# EAGLE design dual-encoding (EAGLE 7.5.0)
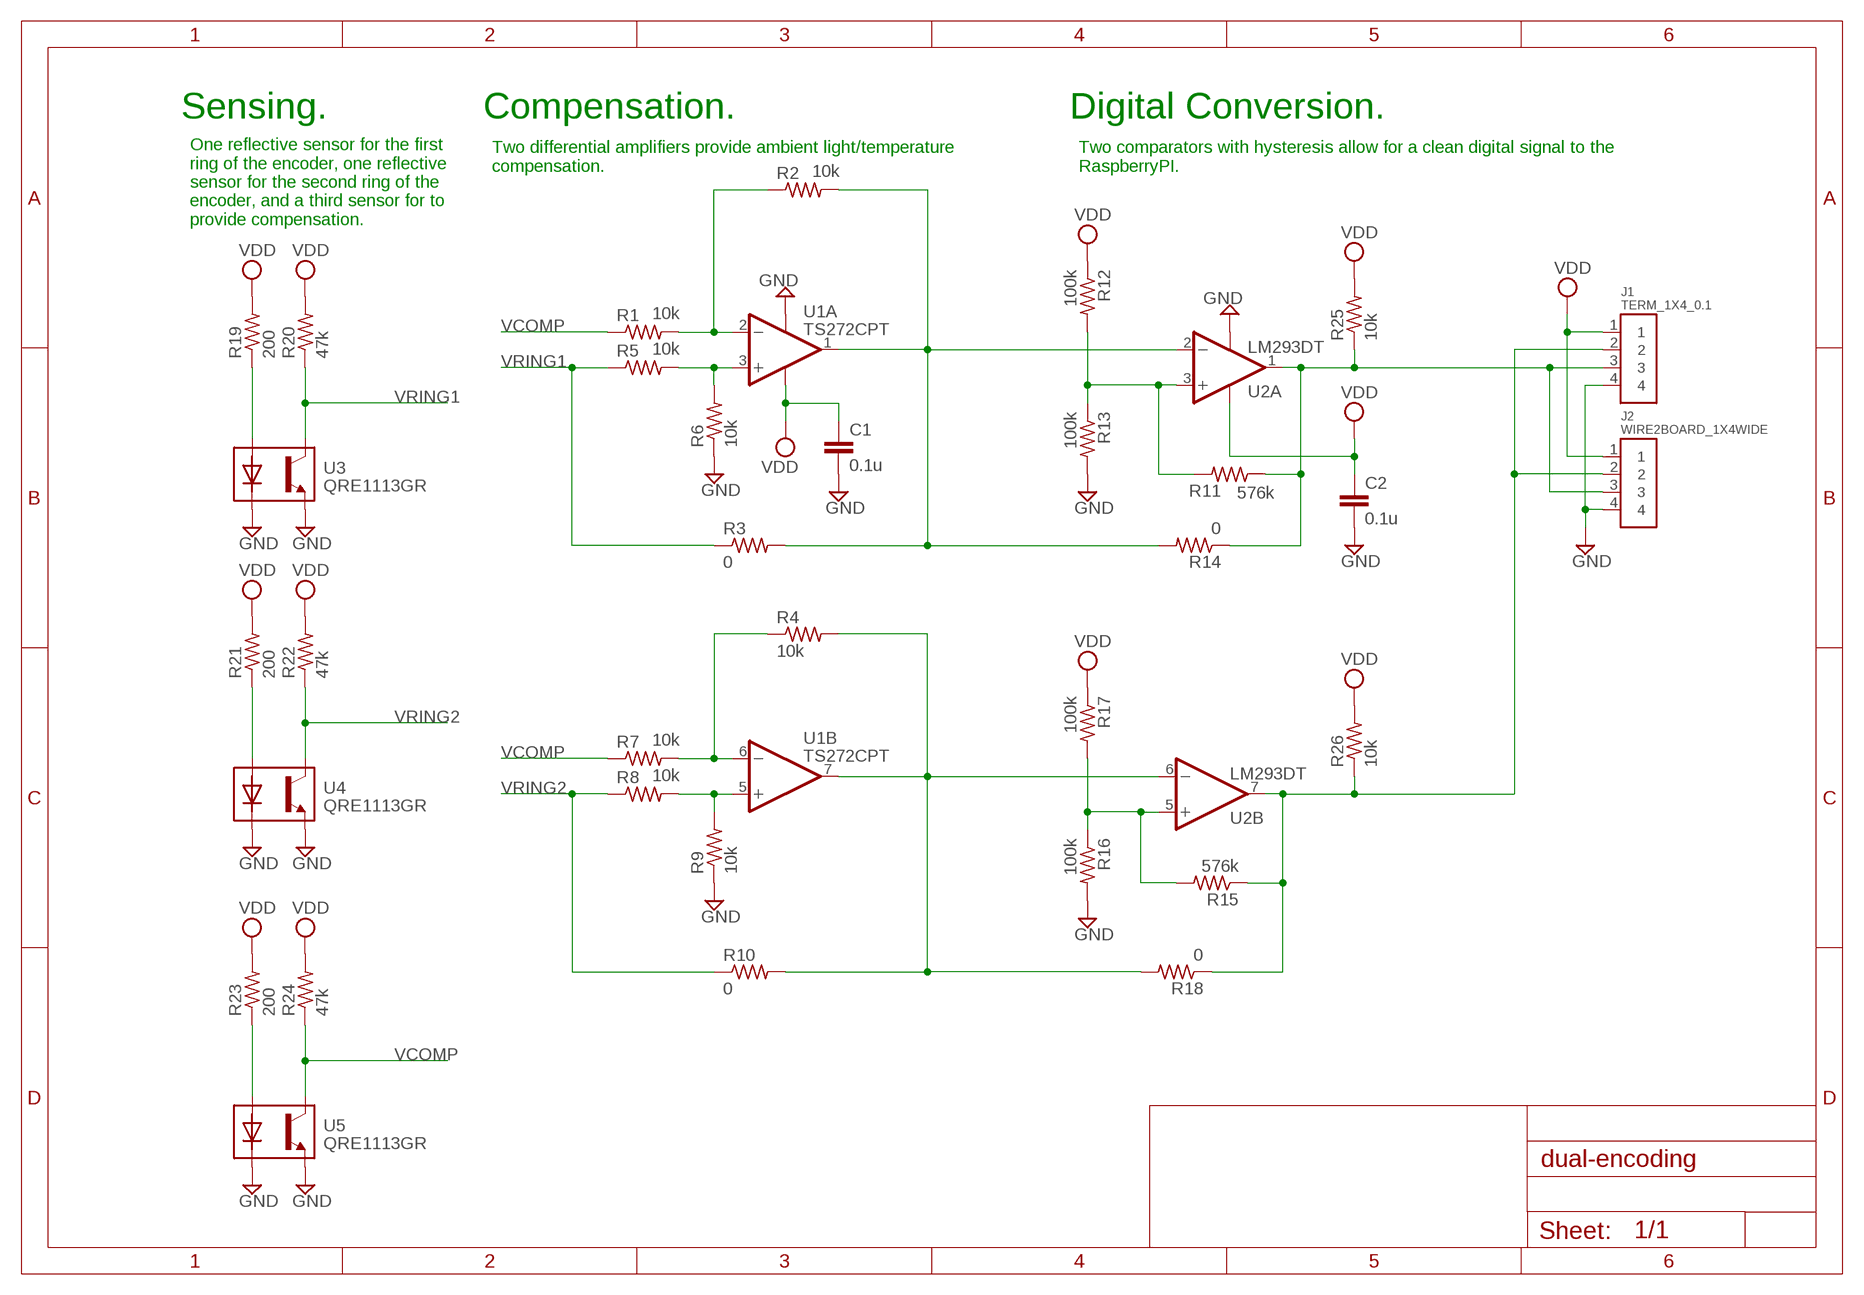
[diagram p0: schematic, sheet 1]

## Parts
C1  0.1u  C0805  [C0805]
C2  0.1u  C0805  [C0805]
J1  TERM_1X4_0.1  [TERM_1X4_0.1]
J2  WIRE2BOARD_1X4WIDE  [WIRE2BOARD_1X4W]
R1  10k  R  [R0805]
R2  10k  R  [R0805]
R3  0  R  [R0805]
R4  10k  R  [R0805]
R5  10k  R  [R0805]
R6  10k  R  [R0805]
R7  10k  R  [R0805]
R8  10k  R  [R0805]
R9  10k  R  [R0805]
R10  0  R  [R0805]
R11  576k  R  [R0805]
R12  100k  R  [R0805]
R13  100k  R  [R0805]
R14  0  R  [R0805]
R15  576k  R  [R0805]
R16  100k  R  [R0805]
R17  100k  R  [R0805]
R18  0  R  [R0805]
R19  200  R  [R0805]
R20  47k  R  [R0805]
R21  200  R  [R0805]
R22  47k  R  [R0805]
R23  200  R  [R0805]
R24  47k  R  [R0805]
R25  10k  R  [R0805]
R26  10k  R  [R0805]
U1  TS272CPT  [TSSOP8]
U2  LM293DT  [SOIC8]
U3  QRE1113GR  [REFL]
U4  QRE1113GR  [REFL]
U5  QRE1113GR  [REFL]

## Nets
GND: C1.2 C2.2 J1.4 J2.4 R6.1 R9.1 R13.2 R16.2 U1.4(A:V-) U2.4(A:V-) U3.2(DC) U3.4(E) U4.2(DC) U4.4(E) U5.2(DC) U5.4(E)
N$1: R5.2 R6.2 U1.3(A:+IN)
N$2: R1.2 R2.1 U1.2(A:-IN)
N$3: R2.2 R3.2 R14.2 U1.1(A:OUT) U2.2(A:-IN)
N$5: R4.1 R7.2 U1.6(B:-IN)
N$6: R4.2 R10.2 R18.2 U1.7(B:OUT) U2.6(B:-IN)
N$7: R8.2 R9.2 U1.5(B:+IN)
N$9: R11.2 R12.2 R13.1 U2.3(A:+IN)
N$10: J1.3 J2.3 R11.1 R14.1 R25.1 U2.1(A:OUT)
N$11: R19.1 U3.1(DA)
N$13: R15.2 R16.1 R17.2 U2.5(B:+IN)
N$14: J1.2 J2.2 R15.1 R18.1 R26.1 U2.7(B:OUT)
N$15: R21.1 U4.1(DA)
N$17: R23.1 U5.1(DA)
VCOMP: R1.1 R7.1 R24.1 U5.3(C)
VDD: C1.1 C2.1 J1.1 J2.1 R12.1 R17.1 R19.2 R20.2 R21.2 R22.2 R23.2 R24.2 R25.2 R26.2 U1.8(A:V+) U2.8(A:V+)
VRING1: R3.1 R5.1 R20.1 U3.3(C)
VRING2: R8.1 R10.1 R22.1 U4.3(C)

## Notes on the sheet
- Sensing. | Compensation. | Digital Conversion.
- Two differential amplifiers provide ambient light/temperature 
  compensation.
- Two comparators with hysteresis allow for a clean digital signal to the 
  RaspberryPI.
- One reflective sensor for the first 
  ring of the encoder, one reflective 
  sensor for the second ring of the
  encoder, and a third sensor for to
  provide compensation.

## Library data of the parts
C1 C2 = dsantoro-discrete:C; DKPN: 1276-6468-1-ND
J1 = dsantoro-conn:TERM_1X4_0.1; DKPN: ED10563-ND
J2 = dsantoro-conn:WIRE2BOARD_1X4
R1 R2 R4-R9 R25 R26 = dsantoro-discrete:R; DKPN: 311-10.0KCRCT-ND
R3 R10 R14 R18 = dsantoro-discrete:R; DKPN: 311-0.0ARCT-ND
R11 R15 = dsantoro-discrete:R; DKPN: 311-576KCRCT-ND
R12 R13 R16 R17 = dsantoro-discrete:R; DKPN: 311-100KCRCT-ND
R19 R21 R23 = dsantoro-discrete:R; DKPN: 311-200ARCT-ND
R20 R22 R24 = dsantoro-discrete:R; DKPN: 311-47KARCT-ND
U1 = dsantoro-op:TS272; DKPN: 497-8079-1-ND
U2 = dsantoro-op:LM293; DKPN: 497-1566-1-ND
U3-U5 = dsantoro-sens:QRE1113; DKPN: QRE1113GRCT-ND

## Board
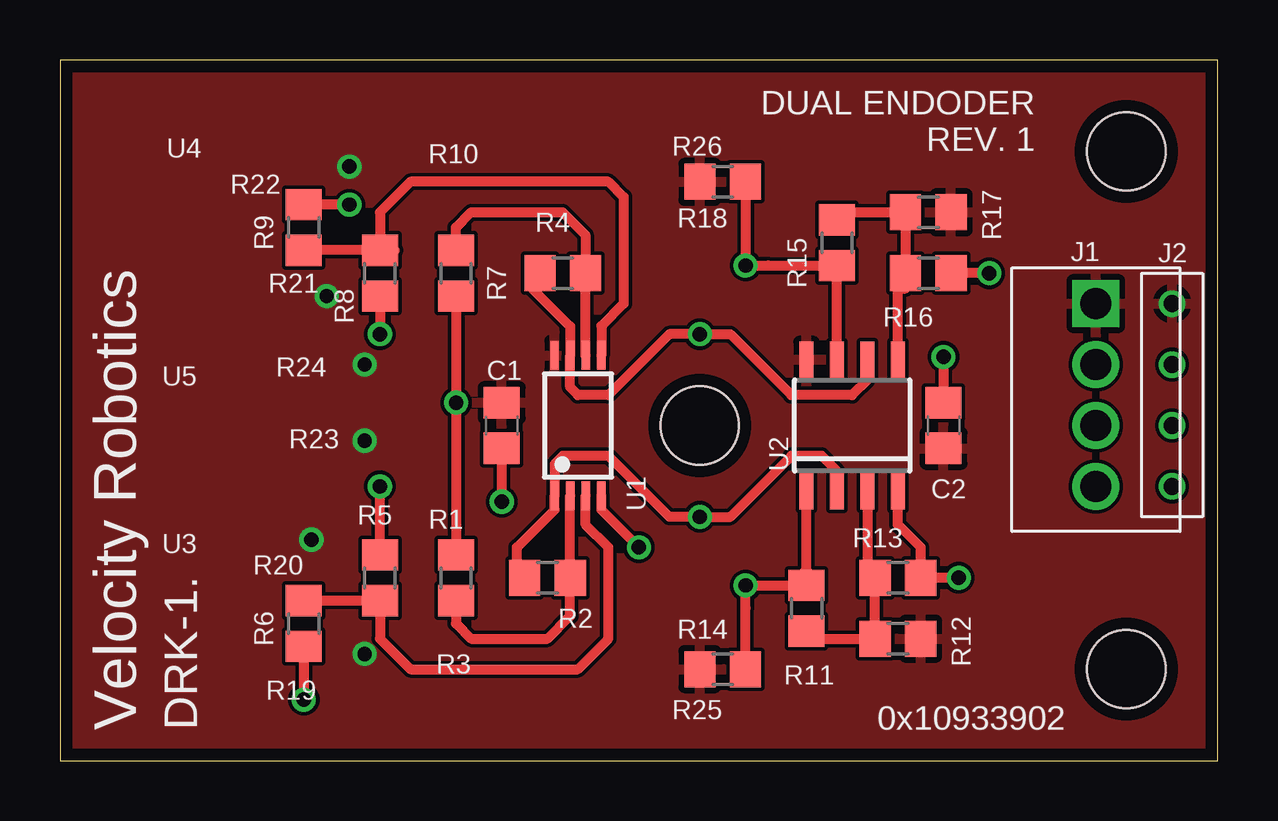
[diagram p1: board, top side]
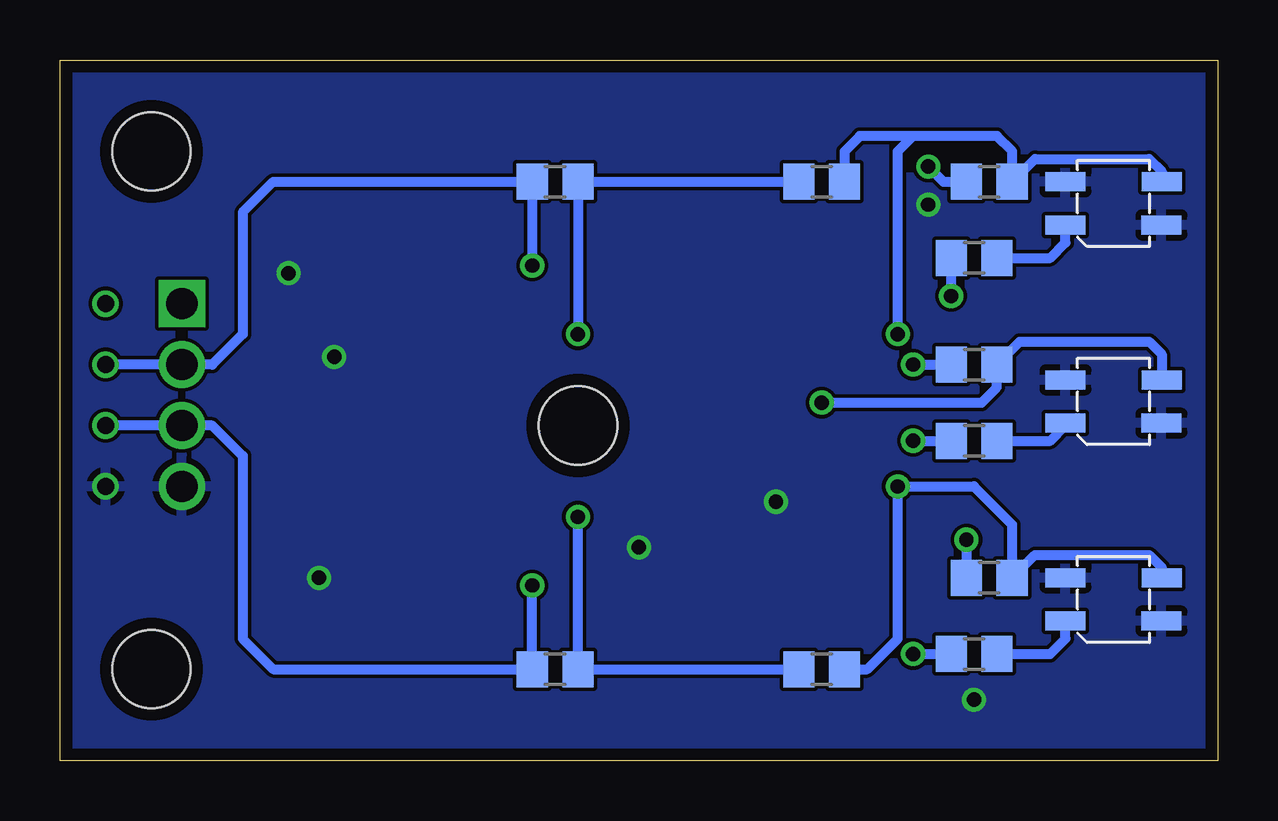
[diagram p2: board, bottom side, seen from below]

Size 48.26 x 29.21 mm. Coordinates in mm from the lower left corner, seen from the top.
Outline: 0,0 48.26,0 48.26,29.21 0,29.21 0,0
Copper layers (1*16): Top 0.0178mm / dielectric 59mil / Bottom 0.0178mm
Design rules "SSC-EAGLE-2Lyr_v1.0.0.3": minimum track width 6mil, minimum drill 14mil, track to track 6mil, track to pad 6mil, pad to pad 6mil, via to via 6mil, smd to smd 6mil, copper to edge 20mil, drill to drill 16mil, minimum pad ring 8mil, minimum via ring 8mil, stop-mask expansion 3mil, vias tented up to drill 0mil, thermal gap 10mil
Holes 3.26 mm at 44.45,25.4 44.45,3.81 26.67,13.97

### Footprints (pad centres in the part's own frame; a part is rotated, then mirrored left to right if it is on the bottom)
C0805 = smd 1.3 x 1.5: 1 -0.95,0; 2 0.95,0
TERM_1X4_0.1 = drill 1.3 square: 1 0,0 | drill 1.3: 2 0,-2.54; 3 0,-5.08; 4 0,-7.62
WIRE2BOARD_1X4W = drill 0.7: 1 0,0; 2 0,-2.54; 3 0,-5.08; 4 0,-7.62
R0805 = smd 1.3 x 1.5: 1 -0.95,0; 2 0.95,0
TSSOP8 = smd 0.35 x 1.2: 1 -0.975,-2.925; 2 -0.325,-2.925; 3 0.325,-2.925; 4 0.975,-2.925; 5 0.975,2.925; 6 0.325,2.925; 7 -0.325,2.925; 8 -0.975,2.925
SOIC8 = smd 0.6 x 1.5: 1 -1.905,-2.75; 2 -0.635,-2.75; 3 0.635,-2.75; 4 1.905,-2.75; 5 1.905,2.75; 6 0.635,2.75; 7 -0.635,2.75; 8 -1.905,2.75
REFL = smd 1.66 x 0.79: 1 0,-1.8; 2 4,-1.8; 3 4.01,0; 4 0,0

### Placement (x,y rotation side)
C1  18.41,13.97 270 top
C2  36.83,13.97 90 top
J1  43.18,19.05 0 top
J2  46.35,19.05 0 top
R1  16.51,7.62 270 top
R2  20.32,7.62 180 top
R3  16.51,3.81 180 bottom
R4  20.95,20.32 180 top
R5  13.34,7.62 270 top
R6  10.16,5.71 90 top
R7  16.51,20.32 90 top
R8  13.34,20.32 90 top
R9  10.16,22.23 270 top
R10  16.51,24.13 180 bottom
R11  31.11,6.35 270 top
R12  34.92,5.08 180 top
R13  34.92,7.62 0 top
R14  27.62,3.81 0 bottom
R15  32.38,21.59 90 top
R16  36.2,20.32 0 top
R17  36.2,22.86 180 top
R18  27.62,24.13 0 bottom
R19  10.16,4.45 180 bottom
R20  9.53,7.62 180 bottom
R21  10.16,20.95 180 bottom
R22  9.53,24.13 180 bottom
R23  10.16,13.34 180 bottom
R24  10.16,16.51 180 bottom
R25  27.62,3.81 180 top
R26  27.62,24.13 180 top
U1  21.59,13.97 0 top
U2  33.02,13.97 0 top
U3  6.35,7.62 0 bottom
U4  6.35,24.13 0 bottom
U5  6.35,15.88 0 bottom

### Tracks (layer width: path | path; a pad name or v marks a point on that pad's centre or on a via)
GND  (via drill 0.6)
  Top 0.406: R6.1 v10.16,2.54 | v12.06,23.18 R9.1 | v37.47,7.62 R13.2 35.88,8.89 34.92,9.84 U2.4 | v38.73,20.32 R16.2 | v36.83,16.83 C2.2 | C1.2 v18.41,10.79 | v24.13,8.89 22.57,10.46 U1.4
  pour Bottom: 0,0 0,29.21 48.26,29.21 48.26,0
N$1
  Top 0.406: U1.3 21.91,9.84 22.86,8.89 22.86,5.08 21.59,3.81 14.61,3.81 13.34,5.08 R5.2 R6.2
N$2
  Top 0.406: U1.2 R2.1 21.27,6.03 20.32,5.08 17.14,5.08 16.51,5.71 R1.2
N$3  (via drill 0.6)
  Top 0.406: R2.2 19.05,7.94 19.05,8.89 20.61,10.46 U1.1 20.61,12.36 20.95,12.7 22.86,12.7 25.4,10.16 v26.67,10.16 27.94,10.16 30.48,12.7 31.75,12.7 32.38,12.06 U2.2
  Bottom 0.406: v26.67,10.16 26.67,5.08 R14.2 R3.2
N$5
  Top 0.406: U1.6 21.91,16.91 R4.1 21.91,21.91 20.95,22.86 17.14,22.86 16.51,22.23 R7.2
N$6  (via drill 0.6)
  Top 0.406: R4.2 19.68,20 19.68,19.68 21.27,18.11 U1.7 21.27,15.56 21.59,15.24 22.86,15.24 25.4,17.78 v26.67,17.78 27.94,17.78 30.48,15.24 33.02,15.24 33.66,15.88 U2.6
  Bottom 0.406: R18.2 v26.67,17.78 | R18.2 | R18.2 R10.2
N$7
  Top 0.406: U1.5 22.57,18.12 23.5,19.05 23.5,23.5 22.86,24.13 14.61,24.13 13.34,22.86 R8.2 13.96,21.27 R9.2
N$9
  Top 0.406: R11.2 31.43,5.08 R12.2 R13.1 | R13.1 33.66,7.94 | U2.3 33.66,7.94 33.98,7.94 R13.1
N$10  (via drill 0.6)
  Top 0.406: U2.1 31.11,7.94 30.8,7.62 R11.1 30.16,7.3 v28.57,7.3 28.57,6.35 R25.1
  Bottom 0.406: v28.57,7.3 28.57,4.12 R25.1 39.37,3.81 40.64,5.08 40.64,12.7 41.91,13.97 J1.3 J2.3
N$11
  Bottom 0.406: R19.1 6.99,4.45 6.35,5.08 U3.1
N$13
  Top 0.406: R15.2 32.7,22.86 R17.2 R16.1 | R16.1 34.92,20 | U2.5 34.92,19.68 35.24,19.68 R16.1
N$14  (via drill 0.6)
  Top 0.406: U2.7 R15.1 29.52,20.64 v28.57,20.64 28.57,23.18 R26.1
  Bottom 0.406: v28.57,20.64 28.57,23.18 R26.1 39.37,24.13 40.64,22.86 40.64,17.78 41.91,16.51 J1.2 J2.2
N$15
  Bottom 0.406: R21.1 6.99,20.95 6.35,21.59 U4.1
N$17
  Bottom 0.406: R23.1 6.99,13.34 6.35,13.97 U5.1
VCOMP  (via drill 0.6)
  Top 0.406: R7.1 v16.51,14.92 R1.1
  Bottom 0.406: U5.3 2.34,16.95 2.86,17.46 8.26,17.46 R24.1 9.21,15.55 9.84,14.92 v16.51,14.92
VDD  (via drill 0.6)
  Bottom 0.406: v12.7,16.51 R24.2 | v12.7,13.34 R23.2 | v12.7,4.45 R19.2 | 10.79,7.62 R20.2 v10.47,9.21 v10.48,9.21 | v12.06,24.77 11.43,24.13 R22.2 | v11.11,19.37 R21.2
  pour Top: 0,29.21 48.26,29.21 48.26,0 0,0
VRING1  (via drill 0.6)
  Top 0.406: R5.1 v13.34,11.43
  Bottom 0.406: U3.3 2.34,8.05 2.86,8.57 7.62,8.57 R20.1 8.57,9.85 10.16,11.43 v13.34,11.43 13.34,5.08 14.61,3.81 R3.1
VRING2  (via drill 0.6)
  Top 0.406: R8.1 v13.34,17.78
  Bottom 0.406: U4.3 2.34,24.57 2.86,25.08 7.62,25.08 R22.1 8.57,25.4 9.21,26.04 12.7,26.04 | 12.7,26.04 14.92,26.04 15.56,25.4 R10.1 | v13.34,17.78 13.34,25.4 12.7,26.04

### Text on the board
tPlace: DUAL ENDODER / REV. 1 | Velocity Robotics | DRK-1. | 0x10933902